# Altium schematic sheet psram.SchDoc
size A
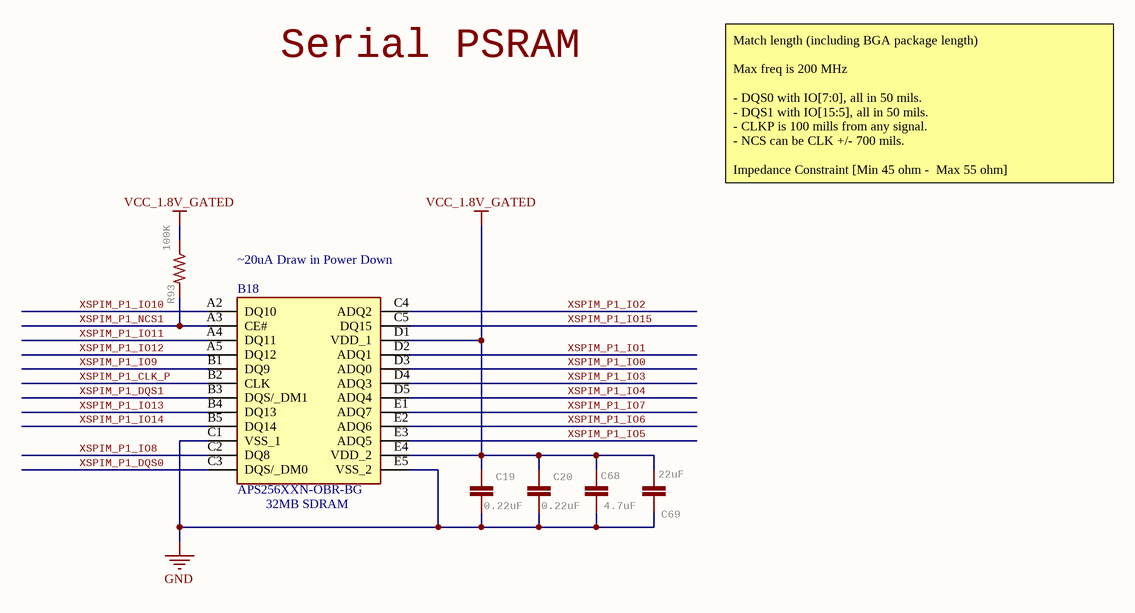
[diagram p0: psram.SchDoc]

## Parts
B18  APS256XXN-OBR-BG  [24-TBGA]
C19  0.22uF  [C0201]
C20  0.22uF  [C0201]
C68  4.7uF  [0402-CAP]
C69  22uF  [0805]
R93  100K  [0402-RES]

## Nets
GND: B18.C1(VSS_1) B18.E5(VSS_2) C19.2 C20.2 C68.1 C69.2
VCC_1.8V_GATED: B18.D1(VDD_1) B18.E4(VDD_2) C19.1 C20.1 C68.2 C69.1 R93.1
XSPIM_P1_CLK_P: B18.B2(CLK)
XSPIM_P1_DQS0: B18.C3(DQS/_DM0)
XSPIM_P1_DQS1: B18.B3(DQS/_DM1)
XSPIM_P1_IO0: B18.D3(ADQ0)
XSPIM_P1_IO1: B18.D2(ADQ1)
XSPIM_P1_IO2: B18.C4(ADQ2)
XSPIM_P1_IO3: B18.D4(ADQ3)
XSPIM_P1_IO4: B18.D5(ADQ4)
XSPIM_P1_IO5: B18.E3(ADQ5)
XSPIM_P1_IO6: B18.E2(ADQ6)
XSPIM_P1_IO7: B18.E1(ADQ7)
XSPIM_P1_IO8: B18.C2(DQ8)
XSPIM_P1_IO9: B18.B1(DQ9)
XSPIM_P1_IO10: B18.A2(DQ10)
XSPIM_P1_IO11: B18.A4(DQ11)
XSPIM_P1_IO12: B18.A5(DQ12)
XSPIM_P1_IO13: B18.B4(DQ13)
XSPIM_P1_IO14: B18.B5(DQ14)
XSPIM_P1_IO15: B18.C5(DQ15)
XSPIM_P1_NCS1: B18.A3(CE#) R93.2

## Notes on the sheet
- Serial PSRAM
- Match length (including BGA package length)
  Max freq is 200 MHz
  - DQS0 with IO[7:0], all in 50 mils.
  - DQS1 with IO[15:5], all in 50 mils.
  - CLKP is 100 mills from any signal.
  - NCS can be CLK +/- 700 mils.
  Impedance Constraint [Min 45 ohm -  Max 55 ohm]
- ~20uA Draw in Power Down
- (near B18) 32MB SDRAM

## Library data of the parts
B18 = APS256XXN-OBR-BG: DRAM IoT RAM 256Mb OPI (x8,x16) DDR 200MHz, 1.8V, Ind. Temp., BGA24; Manufacturer_Name: AP Memory; Geometry.Height: 1.2mm; Mouser Part Number: 878-APS256XXN-OBR-BG; Mouser Price/Stock: https://www.mouser.co.uk/ProductDetail/AP-Memory/APS256XXN-OBR-BG?qs=IS%252B4QmGtzzr0jQp6msfTlA%3D%3D; Manufacturer_Part_Number: APS256XXN-OBR-BG; Datasheet Link: https://www.mouser.ie/datasheet/2/1127/APM_PSRAM_OPI_Xccela_APS256XXN_OBRx_v1_0_PKG-1954780.pdf; Part Number: APS256XXN-OBR-BG; MPN: APS256XXN-OBR-BG
C19 C20 = C-EUC0201: CAPACITOR, European symbol; MPN: GRM033R60J224ME15D; GateName_1: G$1; SymbolName_1: C-EU; POPULARITY: 0; DeviceName: C0201; LibraryName: rcl; DeviceSetName: C-EU; SPICEPREFIX: C; Part Number: GRM033R60J224ME15D
C68 = CAP0402-CAP: CapacitorStandard 0603 ceramic capacitor, and 0.1" leaded capacitor.; MPN: JMK105BBJ475MV-F; GateName_1: G$1; SymbolName_1: CAP; DeviceName: 0402-CAP; LibraryName: sfe; DeviceSetName: CAP; Part Number: JMK105BBJ475MV-F
C69 = 22UF-0805-6.3V-20%: 22ÂµF ceramic capacitors    A capacitor is a passive two-terminal electrical component used to store electrical energy temporarily in an electric field.; MPN: CL21A226MQQNNNE; GateName_1: G$1; SymbolName_1: CAP; PROD_ID: CAP-08402; DeviceName: -0805-6.3V-20%; LibraryName: SparkFun-Capacitors; DeviceSetName: 22UF; Part Number: CL21A226MQQNNNE
R93 = RESISTOR0402-RES: ResistorBasic schematic elements and footprints for 0603, 1206, and PTH resistors.; MPN: AC0402FR-07100KL; GateName_1: G$1; SymbolName_1: RESISTOR; DeviceName: 0402-RES; LibraryName: sfe; DeviceSetName: RESISTOR; Part Number: AC0402FR-07100KL